# EAGLE schematic e202-wickervar (EAGLE 6.6.0)
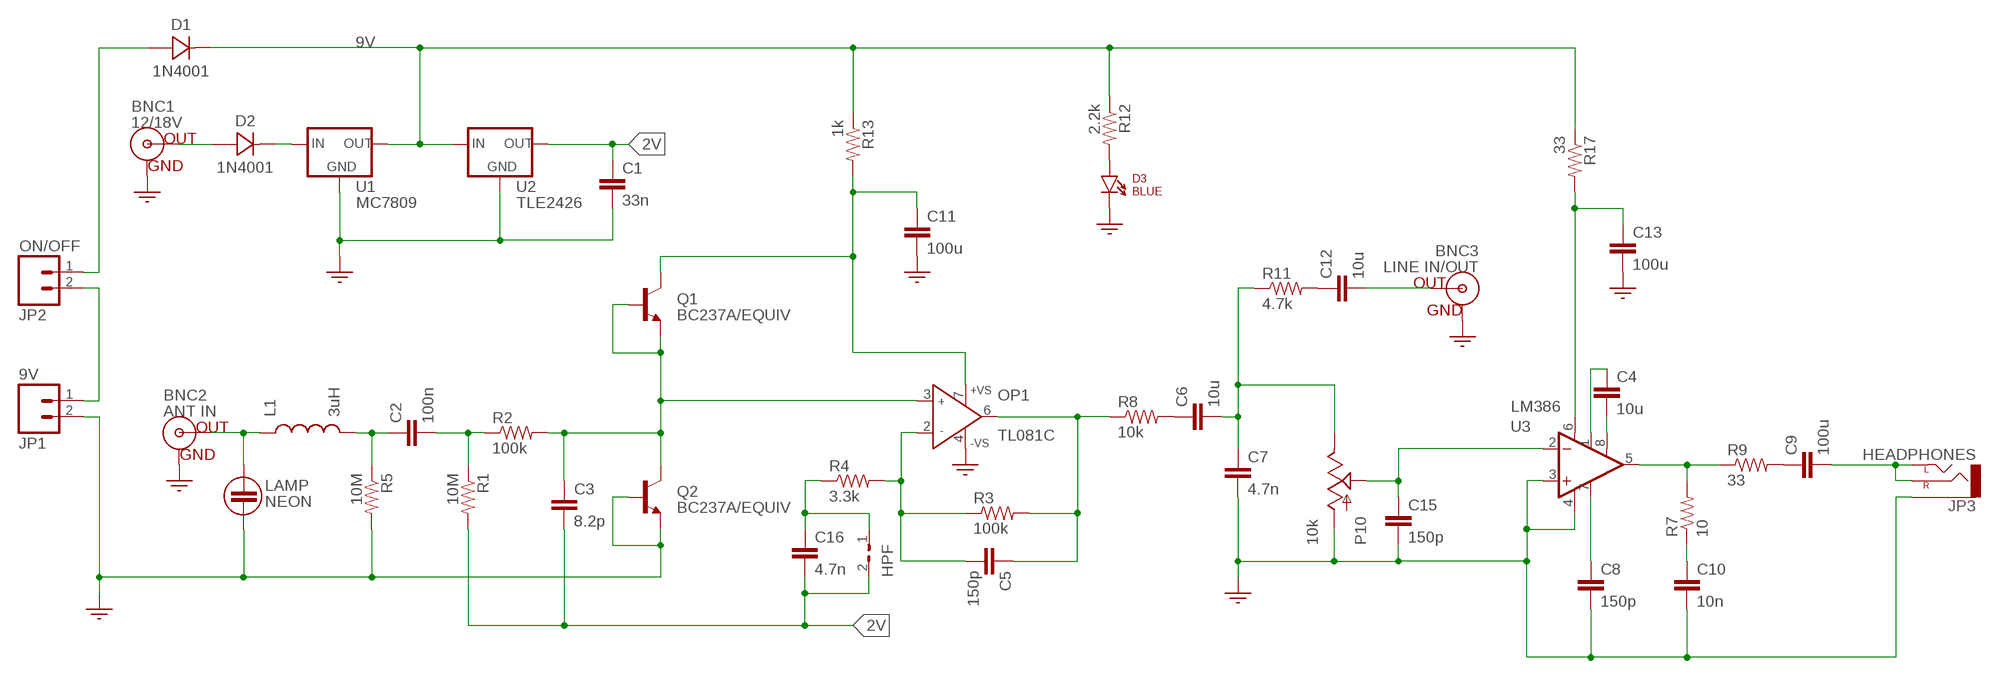
[diagram p0: schematic, sheet 1]

## Parts
BNC1  12/18V  BNCPTH  [BNC]
BNC2  ANT IN  BNCPTH  [BNC]
BNC3  LINE IN/OUT  BNCPTH  [BNC]
C1  33n  CAPKIT  [CAP-PTH-SMALL-KIT]
C2  100n  CAPKIT  [CAP-PTH-SMALL-KIT]
C3  8.2p  CAPKIT  [CAP-PTH-SMALL-KIT]
C4  10u  CAPPTH1  [CAP-PTH-5MM]
C5  150p  CAPKIT  [CAP-PTH-SMALL-KIT]
C6  10u  CAPPTH1  [CAP-PTH-5MM]
C7  4.7n  CAPPTH1  [CAP-PTH-5MM]
C8  150p  CAPKIT  [CAP-PTH-SMALL-KIT]
C9  100u  CAPPTH1  [CAP-PTH-5MM]
C10  10n  CAPKIT  [CAP-PTH-SMALL-KIT]
C11  100u  CAPPTH1  [CAP-PTH-5MM]
C12  10u  CAPPTH1  [CAP-PTH-5MM]
C13  100u  CAPPTH1  [CAP-PTH-5MM]
C15  150p  CAPKIT  [CAP-PTH-SMALL-KIT]
C16  4.7n  CAPKIT  [CAP-PTH-SMALL-KIT]
D1  1N4001  S5BC-13  [SMC]
D2  1N4001  S5BC-13  [SMC]
D3  BLUE  LTE-302  [LTE-302]
HPF  HPF  JUMPER-2PTH_LOCK  [1X02_LOCK]
JP1  9V  M02LOCK  [1X02_LOCK]
JP2  ON/OFF  M02LOCK  [1X02_LOCK]
JP3  HEADPHONES  AUDIO-JACK2.5MM  [STEREOJACK2.5MM_STEREOJACK2.5MM]
L1  3uH  INDUCTORAXIAL-0.6  [AXIAL-0.6]
LAMP  NEON  NEONLAMP  [ESK337M050AH4AA]
OP1  TL081C  AD8597CP  [LFCSP8]
P10  10k  POT  [ALPS_POT]
Q1  BC237A/EQUIV  TRANSISTOR_NPNBC547  [TO-92-AMMO]
Q2  BC237A/EQUIV  TRANSISTOR_NPNBC547  [TO-92-AMMO]
R1  10M  RESISTOREZ  [AXIAL-0.3EZ]
R2  100k  RESISTOREZ  [AXIAL-0.3EZ]
R3  100k  RESISTOREZ  [AXIAL-0.3EZ]
R4  3.3k  RESISTOREZ  [AXIAL-0.3EZ]
R5  10M  RESISTOREZ  [AXIAL-0.3EZ]
R7  10  RESISTOREZ  [AXIAL-0.3EZ]
R8  10k  RESISTOREZ  [AXIAL-0.3EZ]
R9  33  RESISTOREZ  [AXIAL-0.3EZ]
R11  4.7k  RESISTOREZ  [AXIAL-0.3EZ]
R12  2.2k  RESISTOREZ  [AXIAL-0.3EZ]
R13  1k  RESISTOREZ  [AXIAL-0.3EZ]
R17  33  RESISTOREZ  [AXIAL-0.3EZ]
U1  MC7809  V_REG_LD1117VXX  [78XXL]
U2  TLE2426  V_REG_LD1117VXX  [78XXL]
U3  LM386  [DIP08]

## Nets
2V: C1.1 C3.2 C16.2 HPF.2 R1.P$2 U2.GND(OUT)
9V: D1.C(CATHODE) R12.P$1 R13.P$1 R17.P$1 U1.GND(OUT) U2.OUT(IN)
GND: BNC1.GND BNC2.GND BNC3.GND C1.2 C7.2 C8.2 C10.2 C11.2 C13.2 C15.2 D3.C JP1.2 JP3.RING1(SLEEVE) LAMP.C OP1.4(-VS) P10.P$3(A) Q2.2(B) Q2.3(E) R5.P$2 U1.IN(GND) U2.IN(GND) U3.3(+IN) U3.4(V-)
N$1: JP1.1 JP2.2
N$2: D1.A(ANODE) JP2.1
N$3: BNC1.S(OUT) D2.A(ANODE)
N$4: C3.1 OP1.3(IN+) Q1.2(B) Q1.3(E) Q2.1(C) R2.P$2
N$5: D2.C(CATHODE) U1.OUT(IN)
N$6: C11.1 OP1.7(+VS) Q1.1(C) R13.P$2
N$7: BNC2.S(OUT) L1.P$1 LAMP.A
N$8: C5.2 OP1.2(IN-) R3.P$1 R4.P$2
N$9: C2.1 L1.P$2 R5.P$1
N$10: C2.2 R1.P$1 R2.P$1
N$11: C16.1 HPF.1 R4.P$1
N$12: C6.1 R8.P$2
N$13: C5.1 OP1.6(OUT) R3.P$2 R8.P$1
N$14: C6.2 C7.1 P10.P$1(E) R11.P$1
N$15: C12.1 R11.P$2
N$16: C4.1 U3.1(GAIN)
N$17: BNC3.S(OUT) C12.2
N$18: C4.2 U3.8(GAIN)
N$19: C13.1 R17.P$2 U3.6(V+)
N$20: C8.1 U3.7(BP)
N$21: C15.1 P10.P$2(S) U3.2(-IN)
N$22: D3.A R12.P$2
N$23: R7.P$2 R9.P$1 U3.5(OUT)
N$24: C9.1 R9.P$2
N$25: C9.2 JP3.SHIELD(LEFT) JP3.TIP(RIGHT)
N$26: C10.1 R7.P$1

## Library data of the parts
BNC1-BNC3 = SparkFun-Connectors:BNC: BNC Connector, Mouser Part# 5227161
C1-C3 C5 C8 C10 C15 C16 = SparkFun-Capacitors:CAP: Capacitor Standard 0603 ceramic capacitor, and 0.1" leaded capacitor.
C4 C6 C7 C9 C11-C13 = SparkFun-Passives:CAP: Capacitor Standard 0603 ceramic capacitor, and 0.1" leaded capacitor.
D1 D2 = max-viz:S5BC-13
D3 = SparkFun-LED:LTE-302: Through-hole side-firing 940nm IR LED
HPF = SparkFun-Retired:JUMPER-2: Jumper Basic 0.1" spaced jumper. Use with breakaway headers.
JP1 JP2 = SparkFun-Connectors:M02: Standard 2-pin 0.1" header. Use with - straight break away headers ( PRT-00116) - right angle break away headers (PRT-00553) - swiss pins (PRT-00743) - machine pins (PRT-00117) - female headers (PRT-00115) Molex polarized connector foot print use with: PRT-08233 with associated crimp pins and housings. 2.54_SCREWTERM for use with PRT-10571. 3.5mm Screw Terminal footprints for PRT-08084 5mm Screw Terminal footprints for use with PRT-08432
JP3 = SparkFun-Connectors:AUDIO-JACK: 3.5mm Audio Jack Simple 3.5mm common PCB mount audio jack. Variant PTH is our storefront SKU PRT-08032
L1 = SparkFun-Passives:INDUCTOR: Inductors Basic Inductor/Choke - 0603 and 1206. Footprints are not proven and vary greatly between part numbers. SRN6045- 33uH, 20% 1.4A SDR0403-560KL - 56uH, 10%, 500mA RMS/740mA peak
LAMP = max-viz:NEONLAMP
OP1 = analog-devices:AD8597: Single and Dual, Ultralow Distortion, Ultralow Noise Op Amps Source: http://www.analog.com/static/imported-files/data_sheets/AD8597_8599.pdf; OC_FARNELL: unknown; OC_NEWARK: unknown
P10 = SparkFun-Electromechanical:POT; PROD_ID: RES-09177
Q1 Q2 = SparkFun-DiscreteSemi:TRANSISTOR_NPN: Generic NPN BJT MMBT2222A - TRANS-08049 (SOT-23, 1A 40V) MPSA42 - TRANS-09116 (SOT-23, 500mA 300V) MMBT5088LT1G - TRANS-11160 (SOT-23, 50 mA 30V) BC547 - COM-08928 <http://www.sparkfun.com/products/8928> (TO-92 45V 100mA) (1.Collector 2.Base 3.Emitter) 2N3904 - COM-00521 <http://www.sparkfun.com/products/521> (TO-92 40V 200mA) (1.Emitter 2.Base 3.Collector) P2N2222A - COM-12852 <http://www.sparkfun.com/products/12852> (TO-92 40V 600mA) (1.Collector 2.Base 3.Emitter)
R1-R5 R7-R9 R11-R13 R17 = SparkFun-Passives:RESISTOR: Resistor Basic schematic elements and footprints for 0603, 1206, and PTH resistors.
U1 U2 = SparkFun-PowerIC:V_REG_LD1117VXX: LD1117VXX voltage regulator. We carry the 3.3V version (COM-00526) in TO-220 package.
U3 = SparkFun-AnalogIC:LM386: low voltage audio power amplifier